# Altium schematic sheet 12 USB_3.SchDoc
size 420 x 297 mm; Address1: Address1; Address2: Address2; Address3: Address3; Address4: Address4; DocumentNumber: АБВГ.123456.001 Э3; SheetNumber: 12; SheetTotal: 23; Scale: 1:1; DocumentType: Схема электрическая принципиальная; FirstReferrence: АБВГ.123456.001
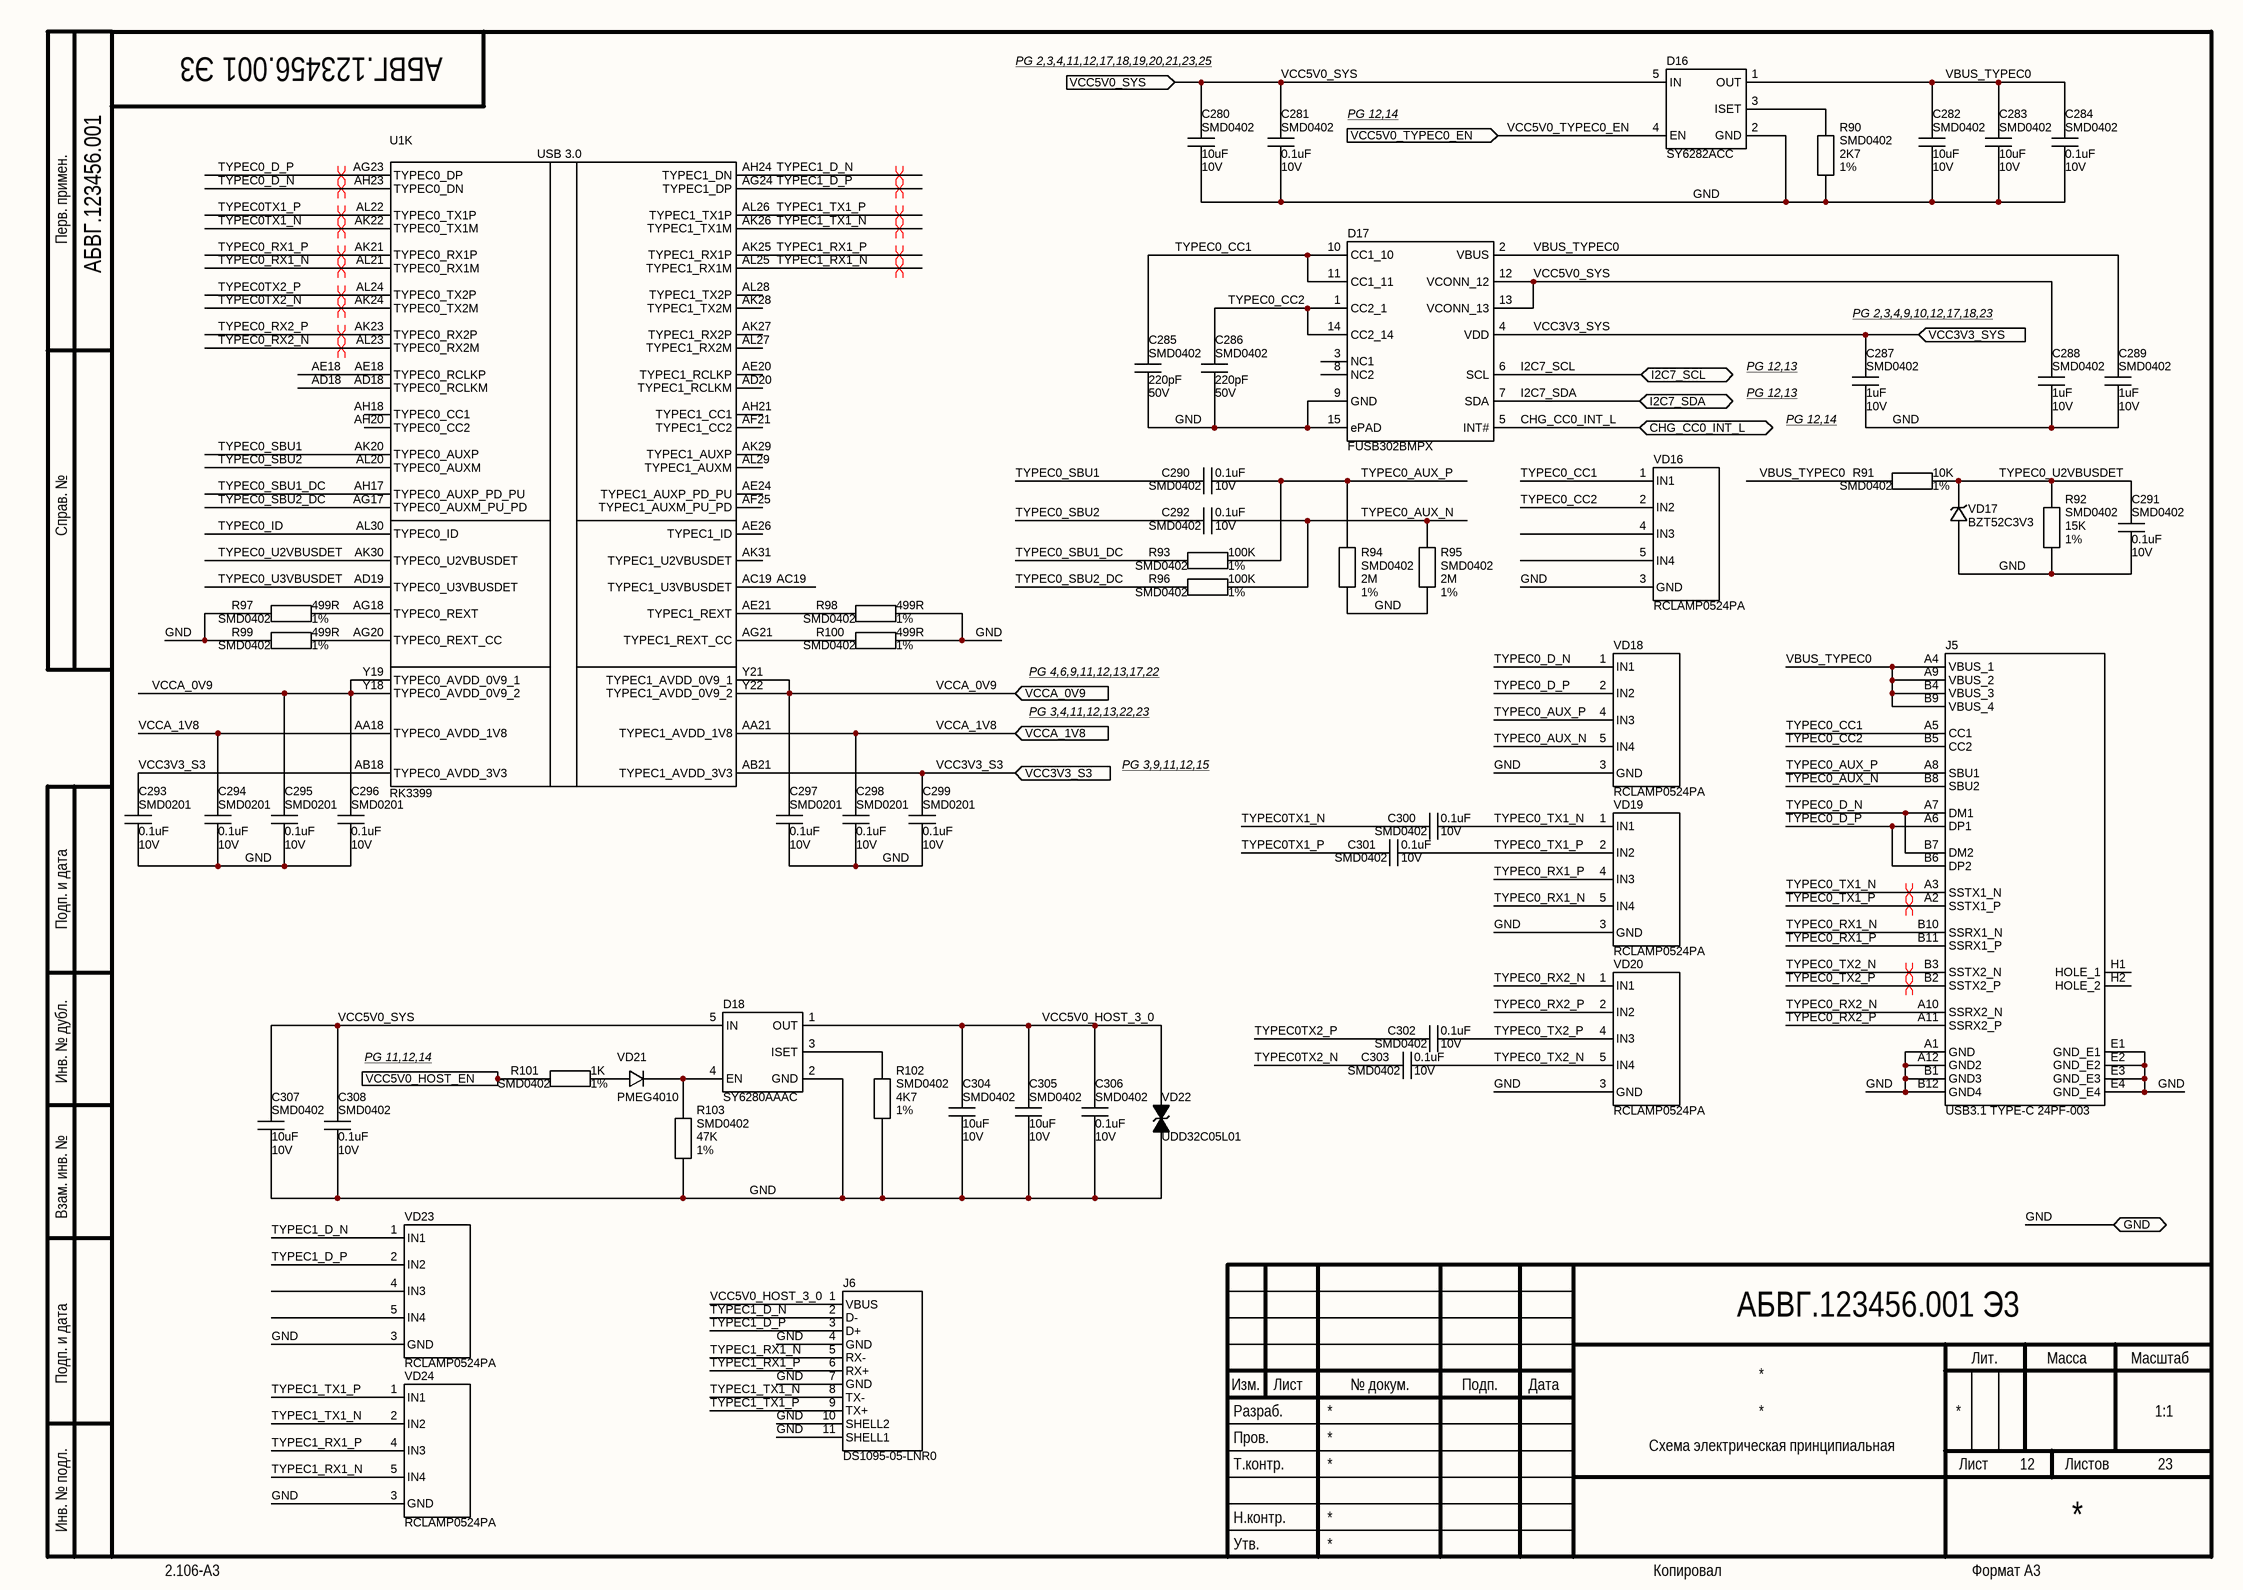
[diagram p0: 12 USB_3.SchDoc]

## Parts
C280  Package: SMD0402  Voltage: 10V  [CAP_SMD_0402]  (hidden comment: 10uF)
C281  Package: SMD0402  Voltage: 10V  [CAP_SMD_0402]  (hidden comment: 0.1uF)
C282  Package: SMD0402  Voltage: 10V  [CAP_SMD_0402]  (hidden comment: 10uF)
C283  Package: SMD0402  Voltage: 10V  [CAP_SMD_0402]  (hidden comment: 10uF)
C284  Package: SMD0402  Voltage: 10V  [CAP_SMD_0402]  (hidden comment: 0.1uF)
C285  Package: SMD0402  Voltage: 50V  [CAP_SMD_0402]  (hidden comment: 220pF)
C286  Package: SMD0402  Voltage: 50V  [CAP_SMD_0402]  (hidden comment: 220pF)
C287  Package: SMD0402  Voltage: 10V  [CAP_SMD_0402]  (hidden comment: 1uF)
C288  Package: SMD0402  Voltage: 10V  [CAP_SMD_0402]  (hidden comment: 1uF)
C289  Package: SMD0402  Voltage: 10V  [CAP_SMD_0402]  (hidden comment: 1uF)
C290  Package: SMD0402  Voltage: 10V  [CAP_SMD_0402]  (hidden comment: 0.1uF)
C291  Package: SMD0402  Voltage: 10V  [CAP_SMD_0402]  (hidden comment: 0.1uF)
C292  Package: SMD0402  Voltage: 10V  [CAP_SMD_0402]  (hidden comment: 0.1uF)
C293  Package: SMD0201  Voltage: 10V  [CAP_SMD_0201]  (hidden comment: 0.1uF)
C294  Package: SMD0201  Voltage: 10V  [CAP_SMD_0201]  (hidden comment: 0.1uF)
C295  Package: SMD0201  Voltage: 10V  [CAP_SMD_0201]  (hidden comment: 0.1uF)
C296  Package: SMD0201  Voltage: 10V  [CAP_SMD_0201]  (hidden comment: 0.1uF)
C297  Package: SMD0201  Voltage: 10V  [CAP_SMD_0201]  (hidden comment: 0.1uF)
C298  Package: SMD0201  Voltage: 10V  [CAP_SMD_0201]  (hidden comment: 0.1uF)
C299  Package: SMD0201  Voltage: 10V  [CAP_SMD_0201]  (hidden comment: 0.1uF)
C300  Package: SMD0402  Voltage: 10V  [CAP_SMD_0402]  (hidden comment: 0.1uF)
C301  Package: SMD0402  Voltage: 10V  [CAP_SMD_0402]  (hidden comment: 0.1uF)
C302  Package: SMD0402  Voltage: 10V  [CAP_SMD_0402]  (hidden comment: 0.1uF)
C303  Package: SMD0402  Voltage: 10V  [CAP_SMD_0402]  (hidden comment: 0.1uF)
C304  Package: SMD0402  Voltage: 10V  [CAP_SMD_0402]  (hidden comment: 10uF)
C305  Package: SMD0402  Voltage: 10V  [CAP_SMD_0402]  (hidden comment: 10uF)
C306  Package: SMD0402  Voltage: 10V  [CAP_SMD_0402]  (hidden comment: 0.1uF)
C307  Package: SMD0402  Voltage: 10V  [CAP_SMD_0402]  (hidden comment: 10uF)
C308  Package: SMD0402  Voltage: 10V  [CAP_SMD_0402]  (hidden comment: 0.1uF)
D16  SY6282ACC  [SOT23-5]
D17  FUSB302BMPX  [WQFN14]
D18  SY6280AAAC  [SOT23-5]
J5  USB3.1 TYPE-C 24PF-003  [USB3.1 TYPE-C 24PF-003]
J6  DS1095-05-LNR0  [DS1095-05-LNR0]
R90  Package: SMD0402  Tolerance: 1%  [RES_SMD_0402]  (hidden comment: 2K7)
R91  Package: SMD0402  Tolerance: 1%  [RES_SMD_0402]  (hidden comment: 10K)
R92  Package: SMD0402  Tolerance: 1%  [RES_SMD_0402]  (hidden comment: 15K)
R93  Package: SMD0402  Tolerance: 1%  [RES_SMD_0402]  (hidden comment: 100K)
R94  Package: SMD0402  Tolerance: 1%  [RES_SMD_0402]  (hidden comment: 2M)
R95  Package: SMD0402  Tolerance: 1%  [RES_SMD_0402]  (hidden comment: 2M)
R96  Package: SMD0402  Tolerance: 1%  [RES_SMD_0402]  (hidden comment: 100K)
R97  Package: SMD0402  Tolerance: 1%  [RES_SMD_0402_SMALL]  (hidden comment: 499R)
R98  Package: SMD0402  Tolerance: 1%  [RES_SMD_0402_SMALL]  (hidden comment: 499R)
R99  Package: SMD0402  Tolerance: 1%  [RES_SMD_0402_SMALL]  (hidden comment: 499R)
R100  Package: SMD0402  Tolerance: 1%  [RES_SMD_0402_SMALL]  (hidden comment: 499R)
R101  Package: SMD0402  Tolerance: 1%  [RES_SMD_0402]  (hidden comment: 1K)
R102  Package: SMD0402  Tolerance: 1%  [RES_SMD_0402]  (hidden comment: 4K7)
R103  Package: SMD0402  Tolerance: 1%  [RES_SMD_0402]  (hidden comment: 47K)
U1  value RK3399  [BGA828C65P31X31_2100X2100X161N]  (hidden comment: RK3399_FF)  (part K of 23)
VD16  RCLAMP0524PA  [RCLAMP0524PA]
VD17  BZT52C3V3  [SOD323]
VD18  RCLAMP0524PA  [RCLAMP0524PA]
VD19  RCLAMP0524PA  [RCLAMP0524PA]
VD20  RCLAMP0524PA  [RCLAMP0524PA]
VD21  value PMEG4010  [SOD323]  (hidden comment: Diode)
VD22  value UDD32C05L01  [SOD323]  (hidden comment: TVS_Diode)
VD23  RCLAMP0524PA  [RCLAMP0524PA]
VD24  RCLAMP0524PA  [RCLAMP0524PA]

## Ports
CHG_CC0_INT_L (bidir), GND (bidir), I2C7_SCL (bidir), I2C7_SDA (bidir), VCC3V3_S3 (in), VCC3V3_SYS (in), VCC5V0_HOST_EN (in), VCC5V0_SYS (in), VCC5V0_TYPEC0_EN (in), VCCA_0V9 (in), VCCA_1V8 (in)

## Nets
AC19: U1.AC19(TYPEC1_U3VBUSDET)
AD18: U1.AD18(TYPEC0_RCLKM)
AE18: U1.AE18(TYPEC0_RCLKP)
CHG_CC0_INT_L: D17.5(INT#) ; port CHG_CC0_INT_L
GND: C280.2 C281.2 C282.2 C283.2 C284.2 C285.2 C286.2 C287.2 C288.2 C289.2 C291.2 C293.2 C294.2 C295.2 C296.2 C297.2 C298.2 C299.2 C304.2 C305.2 C306.2 C307.2 C308.2 D16.2(GND) D17.9(GND) D17.15(ePAD) D18.2(GND) J5.A1(GND) J5.A12(GND2) J5.B1(GND3) J5.B12(GND4) J5.E1(GND_E1) J5.E2(GND_E2) J5.E3(GND_E3) J5.E4(GND_E4) J6.4(GND) J6.7(GND) J6.10(SHELL2) J6.11(SHELL1) R90.2 R92.2 R94.1 R95.1 R97.2 R98.1 R99.2 R100.1 R102.2 R103.2 VD16.3(GND) VD17.1(A) VD18.3(GND) VD19.3(GND) VD20.3(GND) VD22.1(A) VD23.3(GND) VD24.3(GND) ; port GND
I2C7_SCL: D17.6(SCL) ; port I2C7_SCL
I2C7_SDA: D17.7(SDA) ; port I2C7_SDA
TYPEC0_AUX_N: C292.2 J5.B8(SBU2) R95.2 R96.1 VD18.5(IN4)
TYPEC0_AUX_P: C290.2 J5.A8(SBU1) R93.1 R94.2 VD18.4(IN3)
TYPEC0_CC1: C285.1 D17.10(CC1_10) D17.11(CC1_11) J5.A5(CC1) VD16.1(IN1)
TYPEC0_CC2: C286.1 D17.1(CC2_1) D17.14(CC2_14) J5.B5(CC2) VD16.2(IN2)
TYPEC0_D_N: J5.A7(DM1) J5.B7(DM2) U1.AH23(TYPEC0_DN) VD18.1(IN1)
TYPEC0_D_P: J5.A6(DP1) J5.B6(DP2) U1.AG23(TYPEC0_DP) VD18.2(IN2)
TYPEC0_ID: U1.AL30(TYPEC0_ID)
TYPEC0_RX1_N: J5.B10(SSRX1_N) U1.AL21(TYPEC0_RX1M) VD19.5(IN4)
TYPEC0_RX1_P: J5.B11(SSRX1_P) U1.AK21(TYPEC0_RX1P) VD19.4(IN3)
TYPEC0_RX2_N: J5.A10(SSRX2_N) U1.AL23(TYPEC0_RX2M) VD20.1(IN1)
TYPEC0_RX2_P: J5.A11(SSRX2_P) U1.AK23(TYPEC0_RX2P) VD20.2(IN2)
TYPEC0_SBU1: C290.1 U1.AK20(TYPEC0_AUXP)
TYPEC0_SBU1_DC: R93.2 U1.AH17(TYPEC0_AUXP_PD_PU)
TYPEC0_SBU2: C292.1 U1.AL20(TYPEC0_AUXM)
TYPEC0_SBU2_DC: R96.2 U1.AG17(TYPEC0_AUXM_PU_PD)
TYPEC0_TX1_N: C300.2 J5.A3(SSTX1_N) VD19.1(IN1)
TYPEC0_TX1_P: C301.2 J5.A2(SSTX1_P) VD19.2(IN2)
TYPEC0_TX2_N: C303.2 J5.B3(SSTX2_N) VD20.5(IN4)
TYPEC0_TX2_P: C302.2 J5.B2(SSTX2_P) VD20.4(IN3)
TYPEC0_U2VBUSDET: C291.1 R91.1 R92.1 U1.AK30(TYPEC0_U2VBUSDET) VD17.2(C)
TYPEC0_U3VBUSDET: U1.AD19(TYPEC0_U3VBUSDET)
TYPEC0TX1_N: C300.1 U1.AK22(TYPEC0_TX1M)
TYPEC0TX1_P: C301.1 U1.AL22(TYPEC0_TX1P)
TYPEC0TX2_N: C303.1 U1.AK24(TYPEC0_TX2M)
TYPEC0TX2_P: C302.1 U1.AL24(TYPEC0_TX2P)
TYPEC1_D_N: J6.2(D-) U1.AH24(TYPEC1_DN) VD23.1(IN1)
TYPEC1_D_P: J6.3(D+) U1.AG24(TYPEC1_DP) VD23.2(IN2)
TYPEC1_RX1_N: J6.5(RX-) U1.AL25(TYPEC1_RX1M) VD24.5(IN4)
TYPEC1_RX1_P: J6.6(RX+) U1.AK25(TYPEC1_RX1P) VD24.4(IN3)
TYPEC1_TX1_N: J6.8(TX-) U1.AK26(TYPEC1_TX1M) VD24.2(IN2)
TYPEC1_TX1_P: J6.9(TX+) U1.AL26(TYPEC1_TX1P) VD24.1(IN1)
VBUS_TYPEC0: C282.1 C283.1 C284.1 C289.1 D16.1(OUT) D17.2(VBUS) J5.A4(VBUS_1) J5.A9(VBUS_2) J5.B4(VBUS_3) J5.B9(VBUS_4) R91.2
VCC3V3_S3: C293.1 C299.1 U1.AB18(TYPEC0_AVDD_3V3) U1.AB21(TYPEC1_AVDD_3V3) ; port VCC3V3_S3
VCC3V3_SYS: C287.1 D17.4(VDD) ; port VCC3V3_SYS
VCC5V0_HOST_3_0: C304.1 C305.1 C306.1 D18.1(OUT) J6.1(VBUS) VD22.2(C)
VCC5V0_HOST_EN: R101.1 ; port VCC5V0_HOST_EN
VCC5V0_SYS: C280.1 C281.1 C288.1 C307.1 C308.1 D16.5(IN) D17.12(VCONN_12) D17.13(VCONN_13) D18.5(IN) ; port VCC5V0_SYS
VCC5V0_TYPEC0_EN: D16.4(EN) ; port VCC5V0_TYPEC0_EN
VCCA_0V9: C295.1 C296.1 C297.1 U1.Y18(TYPEC0_AVDD_0V9_2) U1.Y19(TYPEC0_AVDD_0V9_1) U1.Y21(TYPEC1_AVDD_0V9_1) U1.Y22(TYPEC1_AVDD_0V9_2) ; port VCCA_0V9
VCCA_1V8: C294.1 C298.1 U1.AA18(TYPEC0_AVDD_1V8) U1.AA21(TYPEC1_AVDD_1V8) ; port VCCA_1V8
NetD16_3: D16.3(ISET) R90.1
NetD18_3: D18.3(ISET) R102.1
NetD18_4: D18.4(EN) R103.1 VD21.2(C)
NetR97_1: R97.1 U1.AG18(TYPEC0_REXT)
NetR98_2: R98.2 U1.AE21(TYPEC1_REXT)
NetR99_1: R99.1 U1.AG20(TYPEC0_REXT_CC)
NetR100_2: R100.2 U1.AG21(TYPEC1_REXT_CC)
NetR101_2: R101.2 VD21.1(A)

Not connected (* = marked no-connect by the designer): D17 3(NC1) 8(NC2); J5 H1(HOLE_1) H2(HOLE_2); U1 AD20(TYPEC1_RCLKM) AE20(TYPEC1_RCLKP) AE24(TYPEC1_AUXP_PD_PU) AE26(TYPEC1_ID) AF21(TYPEC1_CC2) AF25(TYPEC1_AUXM_PU_PD) AH18(TYPEC0_CC1) AH20(TYPEC0_CC2) AH21(TYPEC1_CC1) AK27(TYPEC1_RX2P) AK28(TYPEC1_TX2M) AK29(TYPEC1_AUXP) AK31(TYPEC1_U2VBUSDET) AL27(TYPEC1_RX2M) AL28(TYPEC1_TX2P) AL29(TYPEC1_AUXM); VD16 4(IN3) 5(IN4); VD23 4(IN3) 5(IN4)

## Layout directives
differential pair; differential pair class DiffPair_90_Ohms; net class DiffPair_90_Ohms: TYPEC0_D_N, TYPEC0_D_P, TYPEC0_RX1_N, TYPEC0_RX1_P, TYPEC0_RX2_N, TYPEC0_RX2_P, TYPEC0_TX1_N, TYPEC0_TX1_P, TYPEC0_TX2_N, TYPEC0_TX2_P, TYPEC0TX1_N, TYPEC0TX1_P, TYPEC0TX2_N, TYPEC0TX2_P, TYPEC1_D_N, TYPEC1_D_P, TYPEC1_RX1_N, TYPEC1_RX1_P, TYPEC1_TX1_N, TYPEC1_TX1_P

## Notes on the sheet
- PG 2,3,4,11,12,17,18,19,20,21,23,25
- PG 12,14
- Перв. примен.
- PG 2,3,4,9,10,12,17,18,23
- PG 12,13
- (near C287) PG 12,14
- Справ. №
- PG 3,4,11,12,13,22,23
- PG 4,6,9,11,12,13,17,22
- PG 3,9,11,12,15
- Подп. и дата
- PG 11,12,14
- Инв. № дубл.
- Взам. инв. №
- Разраб.
- Изм.
- Лист
- № докум.
- Подп.
- Дата
- Лит.
- Масса
- Масштаб
- Пров.
- Т.контр.
- Листов
- Инв. № подл.
- Утв.
- Н.контр.
- 2.106-A3
- Копировал
- Формат А3
- (in symbol RK3399_FF, part K) USB 3.0

## Library data of the parts
C280 C282 C283 C304 C305 C307 = Ceramic_Cap: PartNumber: CC0402MRX5R6BB106; ComponentType: SMD Ceramic Chip Capacitor; Manufacter: *; Tolerance: *; ClassName: *; Value: 10uF
C281 C284 C290-C292 C300-C303 C306 C308 = Ceramic_Cap: PartNumber: CC0402KRX5R6BB104; ComponentType: SMD Ceramic Chip Capacitor; Manufacter: *; Tolerance: *; ClassName: *; Value: 0.1uF
C285 C286 = Ceramic_Cap: PartNumber: CC0402JRNPO9BN221; ComponentType: SMD Ceramic Chip Capacitor; Manufacter: *; Tolerance: *; ClassName: *; Value: 220pF
C287-C289 = Ceramic_Cap: PartNumber: CC0402KRX5R6BB105; ComponentType: SMD Ceramic Chip Capacitor; Manufacter: *; Tolerance: *; ClassName: *; Value: 1uF
C293-C299 = Ceramic_Cap: PartNumber: CC0201KRX5R6BB104; ComponentType: SMD Ceramic Chip Capacitor; Manufacter: *; Tolerance: *; ClassName: *; Value: 0.1uF
D16 = SY6280AAAC: ComponentType: SMD Chip Resistor; Manufacter: *; Voltage: *; ClassName: *; Tolerance: *; PartNumber: SY6282ACC; Package: SOT23-5; Value: SY6282ACC
J5 = TYPEC_FUCR-248X-10XX: ComponentType: SMD Chip Resistor; Manufacter: *; Voltage: *; ClassName: *; Tolerance: *; PartNumber: USB3.1 TYPE-C 24PF-003; Package: USB3.1 TYPE-C 24PF-003; Value: USB3.1 TYPE-C 24PF-003
J6 = USB3D0_AF_9P: ComponentType: SMD Chip Resistor; Manufacter: *; Voltage: *; ClassName: *; Tolerance: *; PartNumber: DS1095-05-LNR0; Package: DS1095-05-LNR0; Value: DS1095-05-LNR0
R90 = Chip_Res: PartNumber: RC0402FR-072K7L; ComponentType: SMD Chip Resistor; Manufacter: *; Voltage: *; ClassName: *; Value: 2K7
R91 = Chip_Res: PartNumber: RC0402FR-0710KL; ComponentType: SMD Chip Resistor; Manufacter: *; Voltage: *; ClassName: *; Value: 10K
R92 = Chip_Res: PartNumber: RC0402FR-0715KL; ComponentType: SMD Chip Resistor; Manufacter: *; Voltage: *; ClassName: *; Value: 15K
R93 R96 = Chip_Res: PartNumber: RC0402FR-07100KL; ComponentType: SMD Chip Resistor; Manufacter: *; Voltage: *; ClassName: *; Value: 100K
R94 R95 = Chip_Res: PartNumber: RC0402FR-072ML; ComponentType: SMD Chip Resistor; Manufacter: *; Voltage: *; ClassName: *; Value: 2M
R97-R100 = Chip_Res: PartNumber: RC0402FR-07499RL; ComponentType: SMD Chip Resistor; Manufacter: *; Voltage: *; ClassName: Solder_Clearence; Value: 499R
R101 = Chip_Res: PartNumber: RC0402FR-071KL; ComponentType: SMD Chip Resistor; Manufacter: *; Voltage: *; ClassName: *; Value: 1K
R102 = Chip_Res: PartNumber: RC0402FR-074K7L; ComponentType: SMD Chip Resistor; Manufacter: *; Voltage: *; ClassName: *; Value: 4K7
R103 = Chip_Res: PartNumber: RC0402FR-1347KL; ComponentType: SMD Chip Resistor; Manufacter: *; Voltage: *; ClassName: *; Value: 47K
VD17 = ZenerDiode: ComponentType: *; Manufacter: *; Package: SOD323; PartNumber: BZT52C3V3; ClassName: *; Value: BZT52C3V3
VD21 = Diode: PartNumber: PMEG4010CEJ.115; ComponentType: *; Manufacter: *; Package: SOD323; ClassName: *
D17 = FUSB302BMPX: ComponentType: SMD Chip Resistor; Manufacter: *; Voltage: *; ClassName: *; Tolerance: *; PartNumber: FUSB302BMPX; Package: WQFN14; Value: FUSB302BMPX
D18 = SY6280AAAC: ComponentType: SMD Chip Resistor; Manufacter: *; Voltage: *; ClassName: *; Tolerance: *; PartNumber: SY6280AAAC; Package: SOT23-5; Value: SY6280AAAC
U1 = RK3399_FF: Package: BGA828; ComponentType: *; Manufacter: *; PartNumber: RK3399; ClassName: *
VD16 VD18-VD20 VD23 VD24 = RCLAMP0524PA: ComponentType: *; Manufacter: *; Package: RCLAMP0524PA; PartNumber: RCLAMP0524PA; ClassName: *; Value: RCLAMP0524PA
VD22 = TVS_Diode: ComponentType: *; Manufacter: *; Package: SOD323; PartNumber: UDD32C05L01; ClassName: *